# EAGLE design attiny_prototype (EAGLE 9.6.2)
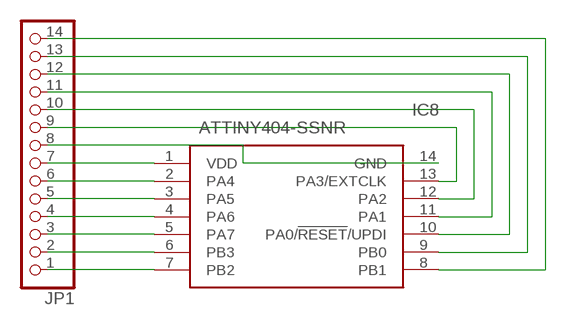
[diagram p0: schematic, sheet 1]

## Parts
IC8  ATTINY404-SSNR  [SOIC127P600X175-14N]
JP1  PINHD-1X14  [1X14]

## Nets
N$1: IC8.7(PB2) JP1.1
N$2: IC8.6(PB3) JP1.2
N$3: IC8.5(PA7) JP1.3
N$4: IC8.4(PA6) JP1.4
N$5: IC8.3(PA5) JP1.5
N$6: IC8.2(PA4) JP1.6
N$7: IC8.1(VDD) JP1.7
N$8: IC8.14(GND) JP1.8
N$9: IC8.13(PA3/EXTCLK) JP1.9
N$10: IC8.12(PA2) JP1.10
N$11: IC8.11(PA1) JP1.11
N$12: IC8.10(PA0/!RESET!/UPDI) JP1.12
N$13: IC8.9(PB0) JP1.13
N$14: IC8.8(PB1) JP1.14

## Library data of the parts
IC8 = SamacSys_Parts:ATTINY404-SSNR: MICROCHIP - ATTINY404-SSNR - MCU, 8BIT, 20MHZ, SOIC-14 Source: Datasheet <https://datasheet.datasheetarchive.com/originals/distributors/DKDS-39/8204.pdf>; DESCRIPTION: MICROCHIP - ATTINY404-SSNR - MCU, 8BIT, 20MHZ, SOIC-14; HEIGHT: 1.75mm; MANUFACTURER_NAME: Microchip; MANUFACTURER_PART_NUMBER: ATTINY404-SSNR; MOUSER_PART_NUMBER: 556-ATTINY404-SSNR; MOUSER_PRICE-STOCK: https://www.mouser.co.uk/ProductDetail/Microchip-Technology-Atmel/ATTINY404-SSNR?qs=F5EMLAvA7IAEqD7Aw0z%252B9Q%3D%3D
JP1 = pinhead:PINHD-1X14: PIN HEADER

## Board
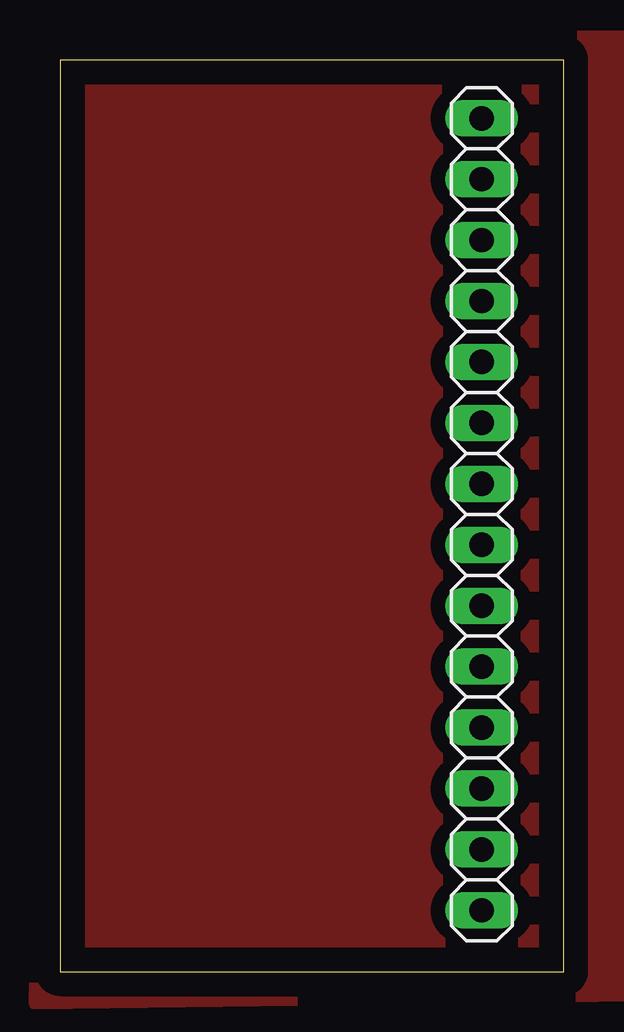
[diagram p1: board, top side]
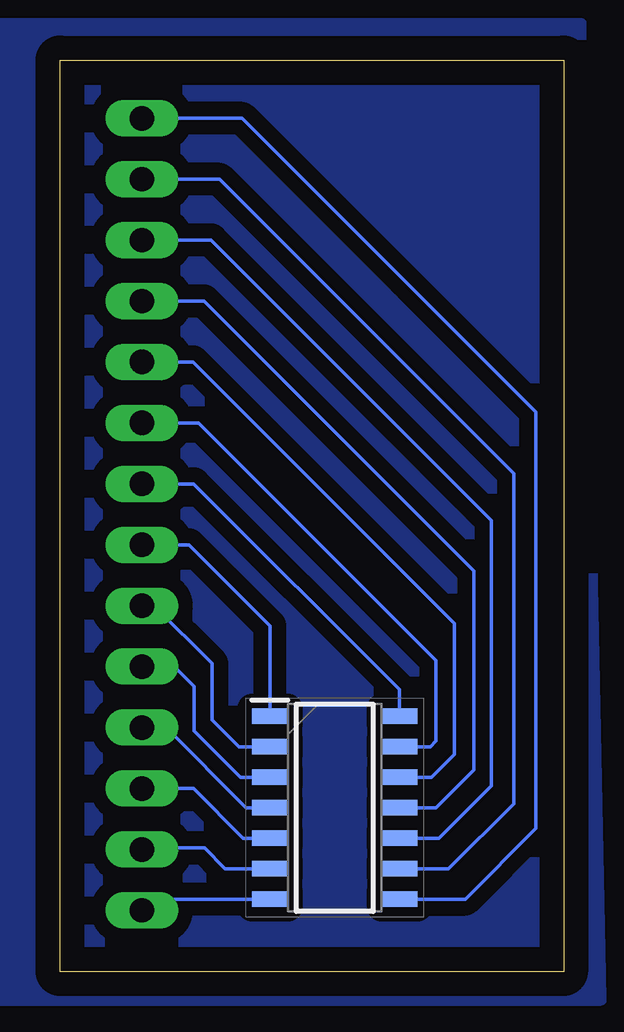
[diagram p2: board, bottom side, seen from below]

Size 21 x 38 mm. Coordinates in mm from the lower left corner, seen from the top.
Outline: 0,0 21,0 21,38 0,38 0,0
Copper layers (1*16): Top 0.035mm / dielectric 1.5mm / Bottom 0.035mm
Design rules "default": minimum track width 6mil, minimum drill 0.35mm, track to track 6mil, track to pad 6mil, pad to pad 6mil, via to via 6mil, smd to smd 6mil, copper to edge 40mil, drill to drill 6mil, minimum pad ring 10mil, minimum via ring 8mil, stop-mask expansion 4mil, vias tented up to drill 0mil, thermal gap 10mil

### Footprints (pad centres in the part's own frame; a part is rotated, then mirrored left to right if it is on the bottom)
SOIC127P600X175-14N = smd 1.5 x 0.65: 1 -2.7,3.81; 2 -2.7,2.54; 3 -2.7,1.27; 4 -2.7,0; 5 -2.7,-1.27; 6 -2.7,-2.54; 7 -2.7,-3.81; 8 2.7,-3.81; 9 2.7,-2.54; 10 2.7,-1.27; 11 2.7,0; 12 2.7,1.27; 13 2.7,2.54; 14 2.7,3.81
1X14 = drill 1.016 long: 1 -16.51,0; 2 -13.97,0; 3 -11.43,0; 4 -8.89,0; 5 -6.35,0; 6 -3.81,0; 7 -1.27,0; 8 1.27,0; 9 3.81,0; 10 6.35,0; 11 8.89,0; 12 11.43,0; 13 13.97,0; 14 16.51,0

### Placement (x,y rotation side)
IC8  9.54,6.83 0 bottom
JP1  17.59,19.06 90 top

### Tracks (layer width: path | path; a pad name or v marks a point on that pad's centre or on a via)
GND
  pour Bottom (isolate 0.61): -0.72,39.5 24.21,39.5 23.58,-1.17 -1.56,-1.17
N$1
  Bottom 0.152: IC8.7 17.12,3.02 JP1.1
N$2
  Bottom 0.152: IC8.6 14.11,4.29 14.97,5.15 17.53,5.15 JP1.2
N$3
  Bottom 0.152: IC8.5 13.36,5.56 15.43,7.63 JP1.3
N$4
  Bottom 0.152: IC8.4 13.24,6.83 16.58,10.17 JP1.4
N$5
  Bottom 0.152: IC8.3 13.47,8.1 15.4,10.03 15.4,11.88 16.23,12.71 JP1.5
N$6
  Bottom 0.152: IC8.2 13.53,9.37 14.66,10.5 14.66,12.84 17.07,15.25 JP1.6
N$7
  Bottom 0.152: IC8.1 12.24,14.41 15.62,17.79 JP1.7
N$8
  Bottom 0.152: IC8.14 6.84,11.75 15.42,20.33 JP1.8
N$9
  Bottom 0.152: IC8.13 5.56,9.37 5.32,9.61 5.32,12.97 15.22,22.87 JP1.9
N$10
  Bottom 0.152: IC8.12 5.51,8.1 4.55,9.06 4.55,14.51 15.45,25.41 JP1.10
N$11
  Bottom 0.152: IC8.11 5.32,6.83 3.74,8.41 3.74,16.7 14.99,27.95 JP1.11
N$12
  Bottom 0.152: IC8.10 5.2,5.56 3.01,7.75 3.01,18.81 14.69,30.49 JP1.12
N$13
  Bottom 0.152: IC8.9 4.79,4.29 2.08,7 2.08,20.76 14.35,33.03 JP1.13
N$14
  Bottom 0.152: IC8.8 4.1,3.02 1.16,5.96 1.16,23.32 13.41,35.57 JP1.14
TOPSIGNAL
  pour Top (isolate 0.61): -0.22,39 24,39 24,-1 -1.05,-1.35